# Altium project Common_Sensor_Box.PrjPCB (part 14 of 17)

## Sheet Sensor_Box_CAN_Shutter_CTRL_STM.SchDoc: Title
size 420 x 297 mm; Author: G.Kasprowicz; CompanyName: WUT ISE; DrawnBy: G.Kasprowicz; Organization: WUT ISE; Address1: PW ISE; Address2: Nowowiejska 15/19 00-665 Warsaw; Address3: gkasprow@gmail.com; Revision: 1.0; SheetNumber: -; SheetTotal: -; ModifiedBy: -; CheckedDate: -; Title2: Title2; DivGrp: WUT ISE; Designer: G.Kasprowicz; ModifiedDate: -; ProjectName: Sensor Box
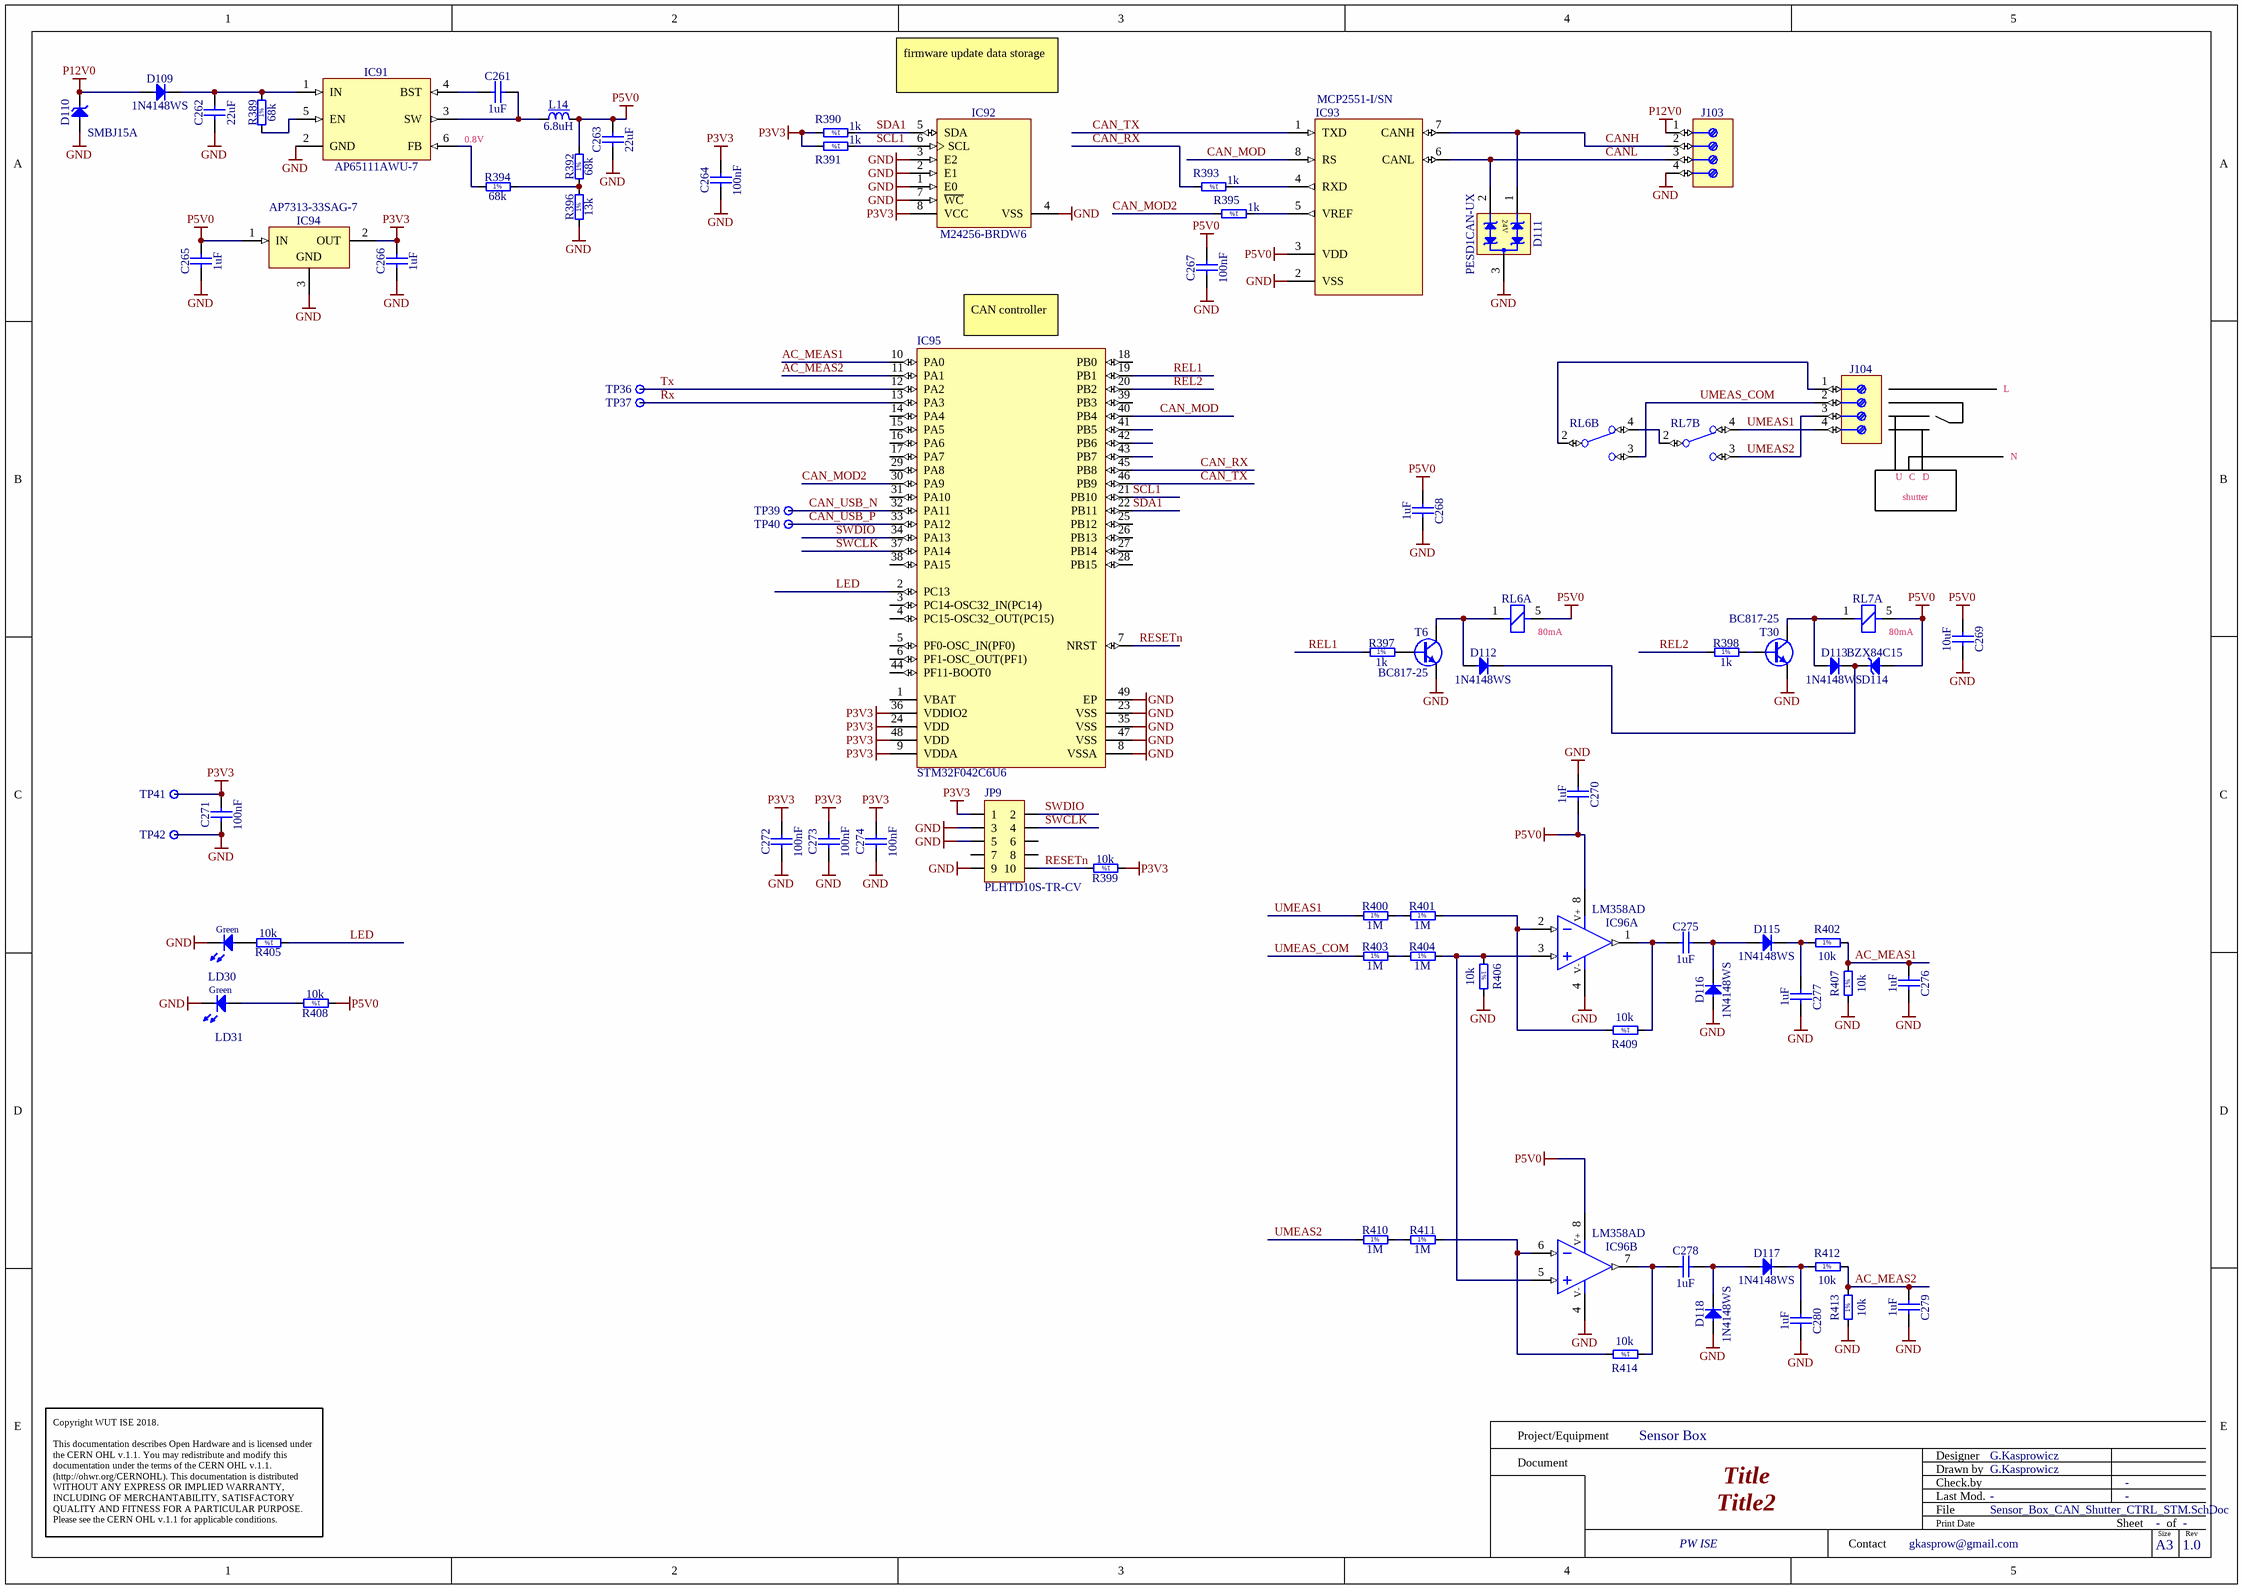
[diagram p19: Sensor_Box_CAN_Shutter_CTRL_STM.SchDoc]

### Parts
C261  1uF  [CAPC1005X55N]
C262  22uF  [CAPC1709X100N]
C263  22uF  [CAPC1709X100N]
C264  100nF  [CAPC1005X55N]
C265  1uF  [CAPC1005X55N]
C266  1uF  [CAPC1005X55N]
C267  100nF  [CAPC1005X55N]
C268  1uF  [CAPC1005X55N]
C269  10uF  [CAPC2012X135N]
C270  1uF  [CAPC1005X55N]
C271  100nF  [CAPC1005X55N]
C272  100nF  [CAPC1005X55N]
C273  100nF  [CAPC1005X55N]
C274  100nF  [CAPC1005X55N]
C275  1uF  [CAPC1005X55N]
C276  1uF  [CAPC1005X55N]
C277  1uF  [CAPC1005X55N]
C278  1uF  [CAPC1005X55N]
C279  1uF  [CAPC1005X55N]
C280  1uF  [CAPC1005X55N]
D109  1N4148WS  [SODFL2512X100N]
D110  SMBJ15A  [DIOM5336X265N]
D111  PESD1CAN-UX  [SOT95P237X112-3N]
D112  1N4148WS  [SODFL2512X100N]
D113  1N4148WS  [SODFL2512X100N]
D114  BZX84C15  [SOT95P240X130-3N]
D115  1N4148WS  [SODFL2512X100N]
D116  1N4148WS  [SODFL2512X100N]
D117  1N4148WS  [SODFL2512X100N]
D118  1N4148WS  [SODFL2512X100N]
IC91  AP65111AWU-7  [SOT95P280X100-6N]
IC92  M24256-BRDW6  [SOP65P640X120-8N]
IC93  MCP2551-I/SN  [SOIC127P600X175-8N]
IC94  AP7313-33SAG-7  [SOT95P240X130-3N]
IC95  STM32F042C6U6  [STM-UFQFPN48_L]
IC96  LM358AD  [SOIC127P600X175-8N]  (parts A,B of 2)
J103  (no value)  [PHOENIX_1725672]
J104  (no value)  [TYCO_282836-4]
JP9  PLHTD10S-TR-CV  [PLHTD10S-TR-CV]
L14  6.8uH  [IND_WALSIN_WLPN3030]
LD30  Green  [LED_KINGBRIGHT_KPH-1608CGCK]
LD31  Green  [LED_KINGBRIGHT_KPH-1608CGCK]
R389  68k  [RESC1005X40N]
R390  1k  [RESC1005X40N]
R391  1k  [RESC1005X40N]
R392  68k  [RESC1005X40N]
R393  1k  [RESC1005X40N]
R394  68k  [RESC1005X40N]
R395  1k  [RESC1005X40N]
R396  13k  [RESC1005X40N]
R397  1k  [RESC1005X40N]
R398  1k  [RESC1005X40N]
R399  10k  [RESC1005X40N]
R400  1M  [RESC3216X65N]
R401  1M  [RESC3216X65N]
R402  10k  [RESC1005X40N]
R403  1M  [RESC3216X65N]
R404  1M  [RESC3216X65N]
R405  10k  [RESC1005X40N]
R406  10k  [RESC1005X40N]
R407  10k  [RESC1005X40N]
R408  10k  [RESC1005X40N]
R409  10k  [RESC1005X40N]
R410  1M  [RESC3216X65N]
R411  1M  [RESC3216X65N]
R412  10k  [RESC1005X40N]
R413  10k  [RESC1005X40N]
R414  10k  [RESC1005X40N]
RL6  REL_OMRON_G5Q-1  [REL_OMRON_G5Q-1]  (value not drawn)  (parts A,B of 2)
RL7  REL_OMRON_G5Q-1  [REL_OMRON_G5Q-1]  (value not drawn)  (parts A,B of 2)
T6  BC817-25  [SOT95P230X110-3N]
T30  BC817-25  [SOT95P230X110-3N]
TP36  Test Point  [TPS127]  (value not drawn)
TP37  Test Point  [TPS127]  (value not drawn)
TP39  Test Point  [TPS127]  (value not drawn)
TP40  Test Point  [TPS127]  (value not drawn)
TP41  Test Point  [TPS127]  (value not drawn)
TP42  Test Point  [TPS127]  (value not drawn)

### Nets
GND: C262.1 C263.1 C264.1 C265.1 C266.1 C267.1 C268.2 C269.2 C270.1 C271.1 C272.1 C273.1 C274.1 C276.2 C277.2 C279.2 C280.2 D110.2(A) D111.3(GND) D116.2(A) D118.2(A) IC91.2(GND) IC92.1(E0) IC92.2(E1) IC92.3(E2) IC92.4(VSS) IC92.7(~{WC}) IC93.2(VSS) IC94.3(GND) IC95.8(VSSA) IC95.23(VSS) IC95.35(VSS) IC95.47(VSS) IC95.49(EP) IC96.4(V-) J103.4 JP9.3 JP9.5 JP9.9 LD30.1(C) LD31.1(C) R396.1 R406.2 R407.1 R413.1 T6.2(E) T30.2(E) TP42.1
P3V3: C264.2 C266.2 C271.2 C272.2 C273.2 C274.2 IC92.8(VCC) IC94.2(OUT) IC95.9(VDDA) IC95.24(VDD) IC95.36(VDDIO2) IC95.48(VDD) JP9.1 R390.2 R391.2 R399.1 TP41.1
P5V0: C263.2 C265.2 C267.2 C268.1 C269.1 C270.2 D114.1(A) IC93.3(VDD) IC94.1(IN) IC96.8(V+) L14.2 R392.2 R408.1 RL6.5 RL7.5
P12V0: D109.2(A) D110.1(C) J103.1
AC_MEAS1: C276.1 IC95.10(PA0) R402.2 R407.2
AC_MEAS2: C279.1 IC95.11(PA1) R412.2 R413.2
CAN_MOD: IC93.8(RS) IC95.40(PB4)
CAN_MOD2: IC95.30(PA9) R395.2
CAN_RX: IC95.45(PB8) R393.2
CAN_TX: IC93.1(TXD) IC95.46(PB9)
CAN_USB_N: IC95.32(PA11) TP39.1
CAN_USB_P: IC95.33(PA12) TP40.1
CANH: D111.1(I/O1) IC93.7(CANH) J103.2
CANL: D111.2(I/O2) IC93.6(CANL) J103.3
LED: IC95.2(PC13) R405.1
REL1: IC95.19(PB1) R397.1
REL2: IC95.20(PB2) R398.1
RESETn: IC95.7(NRST) JP9.10 R399.2
Rx: IC95.13(PA3) TP37.1
SCL1: IC92.6(SCL) IC95.21(PB10) R391.1
SDA1: IC92.5(SDA) IC95.22(PB11) R390.1
SWCLK: IC95.37(PA14) JP9.4
SWDIO: IC95.34(PA13) JP9.2
Tx: IC95.12(PA2) TP36.1
UMEAS1: J104.4 R400.1 RL7.4(NC)
UMEAS2: J104.3 R410.1 RL7.3(NO)
UMEAS_COM: J104.2 R403.1 RL6.3(NO)
NetC261_1: C261.1 IC91.4(BST)
NetC261_2: C261.2 IC91.3(SW) L14.1
NetC262_2: C262.2 D109.1(C) IC91.1(IN) R389.2
NetC275_1: C275.1 IC96.1(OUT) R409.1
NetC275_2: C275.2 D115.2(A) D116.1(C)
NetC277_1: C277.1 D115.1(C) R402.1
NetC278_1: C278.1 IC96.7(OUT) R414.1
NetC278_2: C278.2 D117.2(A) D118.1(C)
NetC280_1: C280.1 D117.1(C) R412.1
NetD112_1: D112.1(C) D113.1(C) D114.3(C)
NetD112_2: D112.2(A) RL6.1 T6.3(C)
NetD113_2: D113.2(A) RL7.1 T30.3(C)
NetIC91_5: IC91.5(EN) R389.1
NetIC91_6: IC91.6(FB) R394.1
NetIC93_4: IC93.4(RXD) R393.1
NetIC93_5: IC93.5(VREF) R395.1
NetIC96_2: IC96.2(IN-) R401.2 R409.2
NetIC96_3: IC96.3(IN+) IC96.5(IN+) R404.2 R406.1
NetIC96_6: IC96.6(IN-) R411.2 R414.2
NetJ104_1: J104.1 RL6.2(C)
NetLD30_2: LD30.2(A) R405.2
NetLD31_2: LD31.2(A) R408.2
NetR392_1: R392.1 R394.2 R396.2
NetR397_2: R397.2 T6.1(B)
NetR398_2: R398.2 T30.1(B)
NetR400_2: R400.2 R401.1
NetR403_2: R403.2 R404.1
NetR410_2: R410.2 R411.1
NetRL6_4: RL6.4(NC) RL7.2(C)

Not connected (* = marked no-connect by the designer): IC95 1(VBAT) 3(PC14-OSC32_IN(PC14)) 4(PC15-OSC32_OUT(PC15)) 5(PF0-OSC_IN(PF0)) 6(PF1-OSC_OUT(PF1)) 14(PA4) 15(PA5) 16(PA6) 17(PA7) 18(PB0) 25(PB12) 26(PB13) 27(PB14) 28(PB15) 29(PA8) 31(PA10) 38(PA15) 39(PB3) 41(PB5) 42(PB6) 43(PB7) 44(PF11-BOOT0); JP9 6 7 8

### Notes on the sheet
- firmware update data storage
- 0.8V
- (near IC95) CAN controller
- L
- N
- U
- shutter
- C
- D
- (near RL6) 80mA
- (near RL7) 80mA
- Project/Equipment
- Document
- Designer
- Drawn by
- Check.by
- Copyright WUT ISE 2018.
  This documentation describes Open Hardware and is licensed under the CERN OHL v.1.1. You may redistribute and modify this documentation under the terms of the CERN OHL v.1.1. (http://ohwr.org/CERNOHL). This documentation is distributed WITHOUT ANY EXPRESS OR IMPLIED WARRANTY, INCLUDING OF MERCHANTABILITY, SATISFACTORY QUALITY AND FITNESS FOR A PARTICULAR PURPOSE. Please see the CERN OHL v.1.1 for applicable conditions.
- Contact
- File
- Last Mod.
- Print Date
- Sheet
- Size
- A3
- of
- Rev
- (in symbol R0402_1K_1%_0.0625W_100PPM) 1%
- (in symbol R0402_10K_1%_0.0625W_100PPM) 1%
- (in symbol R0402_13K_1%_0.0625W_100PPM) 1%
- (in symbol R0402_68K_1%_0.0625W_100PPM) 1%
- (in symbol R1206_1M_1%_0.25W_100PPM) 1%

### Library data of the parts
C261 C265 C266 C268 C270 C275-C280 = CC0402_1UF_16V_10%_X5R: as C122 on sheet Sensor_Box_CAN_SENS; Part Number: CC0402_1UF_16V_10%_X5R; Component Kind: Standard; Component Type: Standard; Pin Count: 2; Value: 1uF; Status: Preferred; Manufacturer Part Number: CC0402_1UF_16V_10%_X5R; Case: 0402; Mounted: Yes; Socket: No; SMD: Yes; Sense: No; Manufacturer1 Example: TDK; Manufacturer1 ComponentHeight: 0.55mm; HelpURL: \\cern.ch\dfs\Applications\Altium\Datasheets\CC0402_X5R_TDK_C.pdf; Author: CERN DEM JLC; CreateDate: 25.10.2012; LatestRevisionDate: 25.10.2012
C262 C263 = CC0603_22UF_6.3V_20%_X5R: as C123 on sheet Sensor_Box_CAN_SENS; Part Number: CC0603_22UF_6.3V_20%_X5R; Component Kind: Standard; Component Type: Standard; Pin Count: 2; Value: 22uF; Status: None; Manufacturer Part Number: CC0603_22UF_6.3V_20%_X5R; Case: 0603; Mounted: Yes; Socket: No; SMD: Yes; Sense: No; Manufacturer1 Example: TDK; Manufacturer1 ComponentHeight: 1mm; HelpURL: \\cern.ch\dfs\Applications\Altium\Datasheets\CC0603_X5R_TDK_C.pdf; Author: CERN DEM JLC; CreateDate: 16.12.2013; LatestRevisionDate: 13.09.2016
C264 C267 C271-C274 = CC0402_100NF_16V_10%_X5R: as C120 on sheet Sensor_Box_CAN_SENS; Part Number: CC0402_100NF_16V_10%_X5R; Component Kind: Standard; Component Type: Standard; Pin Count: 2; Value: 100nF; Status: None; Manufacturer Part Number: CC0402_100NF_16V_10%_X5R; Case: 0402; Mounted: Yes; Socket: No; SMD: Yes; Sense: No; Manufacturer1 Example: MURATA; Manufacturer1 ComponentHeight: 0.55mm; HelpURL: \\cern.ch\dfs\Applications\Altium\Datasheets\CC0402_X5R_MURATA_GRM.pdf; Author: CERN DEM JLC; CreateDate: 10.12.2013; LatestRevisionDate: 10.12.2013
C269 = CC0805_10UF_16V_10%_X5R: as C194 on sheet Sensor_Box_CAN_Shutter_CTRL; Part Number: CC0805_10UF_16V_10%_X5R; Component Kind: Standard; Component Type: Standard; Pin Count: 2; Value: 10uF; Status: Preferred; Manufacturer Part Number: CC0805_10UF_16V_10%_X5R; Case: 0805; Mounted: Yes; Socket: No; SMD: Yes; Manufacturer1 Example: KEMET; Manufacturer1 ComponentHeight: 1.4mm; HelpURL: \\cern.ch\dfs\Applications\Altium\Datasheets\CC1206_X5R_KEMET.pdf; Author: CERN DEM JLC; CreateDate: 03.12.2007; LatestRevisionDate: 03.12.2007; Sense: No
D109 D112 D113 D115-D118 = 1N4148WS: as D29 on sheet Sensor_Box_CAN_SENS; Part Number: 1N4148WS; Component Kind: Standard; Component Type: Standard; Device: 1N4148WS; PackageDescription: SODFL Diode; 1.70mm W X 1.25mm L X 1.00mm H body, IPC Medium Density; Manufacturer Part Number: 1N4148WS; Pin Count: 2; Case: SOD-323F; Mounted: Yes; Socket: No; SMD: Yes; Sense: No; ComponentHeight: 1mm; HelpURL: \\cern.ch\dfs\Applications\Altium\Datasheets\1N4148WS.pdf; Author: CERN DEM JLC; CreateDate: 12.05.2011; LatestRevisionDate: 12.05.2011
D110 = SMBJ15A: as D62 on sheet Sensor_Box_CAN_SENS; Part Number: SMBJ15A; Component Kind: Standard; Component Type: Standard; Device: SMBJ15A; PackageDescription: DO-214-AA/SMB Diode, Molded Body; 5.34mm L X 3.625mm W X 2.65mm H, IPC Medium Density; Manufacturer Part Number: SMBJ15A; Pin Count: 2; Case: DO-214AA; Mounted: Yes; Socket: No; SMD: Yes; Sense: No; ComponentHeight: 2.65mm; HelpURL: \\cern.ch\dfs\Applications\Altium\Datasheets\SMBJ.pdf; Author: CERN DEM JLC; CreateDate: 08.12.2008; LatestRevisionDate: 19.12.2011
D111 = D_TVS_PESD1CAN: as D28 on sheet Sensor_Box_CAN_SENS; Part Number: PESD1CAN-UX; Component Kind: Standard; Component Type: Standard; Device: PESD1CAN-UX; PackageDescription: SOT, 0.95mm, pitch; 3 pin,1.30mm W X 2.92mm L X 1.12mm H body, IPC Medium Density; Part Description: TVS Diode for CAN; Manufacturer Part Number: PESD1CAN-UX; Pin Count: 3; Case: SOT-23; Mounted: Yes; Socket: No; SMD: Yes; Sense: No; ComponentHeight: 1.12mm; HelpURL: \\cern.ch\dfs\Applications\Altium\Datasheets\SM712.TCT.pdf; Author: CERN DEM JLC; CreateDate: 03.09.2014; LatestRevisionDate: 13.01.2015
D114 = BZX84C15: as D68 on sheet Sensor_Box_CAN_Shutter_CTRL; Part Number: BZX84C15; Component Kind: Standard; Component Type: Standard; Device: BZX84C15; PackageDescription: SOT23 3-Leads, Pitch 0.95mm - Body 1.3x2.9mm, IPC Medium Density; Manufacturer Part Number: BZX84C15; Pin Count: 3; Case: SOT23-3; Mounted: Yes; Socket: No; SMD: Yes; Sense: No; ComponentHeight: 1.3mm; HelpURL: \\cern.ch\dfs\Applications\Altium\Datasheets\BZX84C15.pdf; Author: CERN DEM JLC; CreateDate: 30.11.2011; LatestRevisionDate: 30.11.2011
IC91 = AP65111AWU-7: as IC36 on sheet Sensor_Box_CAN_SENS; Part Number: AP65111AWU-7; Component Kind: Standard; Component Type: Standard; Device: AP65111AWU-7; PackageDescription: SOT23, 0.95mm pitch; 6 pin, 1.625mm W X 2.90mm L X 1.00mm H body, IPC Medium Density; Part Description: Light Load Improved 1.5A Synch DC/DC Buck Converter; Manufacturer Part Number: AP65111AWU-7; Pin Count: 6; Case: SOT23-6; Mounted: Yes; Socket: No; SMD: Yes; Sense: No; ComponentHeight: 1.1mm; HelpURL: \\cern.ch\dfs\Applications\Altium\Datasheets\AP65111AWU-7.pdf; Author: CERN DEM JLC; CreateDate: 20.03.2018; LatestRevisionDate: 20.03.2018
IC92 = MEM_M24256-BRDW6P: as IC29 on sheet Sensor_Box_CAN_SENS; Part Number: M24256-BRDW6P; Component Kind: Standard; Component Type: Standard; Device: M24256-BRDW6; PackageDescription: SOP, 0.65mm pitch; 8 pin, 4.40mm W X 3.00mm L X 1.20mm H body, IPC Medium Density; Part Description: 256-Kbit Serial I²C Bus EEPROM; Manufacturer Part Number: M24256-BRDW6; Pin Count: 8; Case: TSSOP8; Mounted: Yes; Socket: No; SMD: Yes; Sense: No; ComponentHeight: 1.2mm; HelpURL: \\cern.ch\dfs\Applications\Altium\Datasheets\M24256-BRDW6P.pdf; Author: CERN DEM MR; CreateDate: 17.03.2016; LatestRevisionDate: 17.03.2016
IC93 = IFC_MCP2551: as IC34 on sheet Sensor_Box_CAN_SENS; Part Number: MCP2551-I/SN; Component Kind: Standard; Component Type: Standard; Device: MCP2551-I/SN; PackageDescription: SOIC 8, Pitch 1.27mm - Body 4x5mm, IPC Medium Density; Part Description: High-Speed CAN Transceiver; Manufacturer Part Number: MCP2551-I/SN; Pin Count: 8; Case: SOIC8; Mounted: Yes; Socket: No; SMD: Yes; Sense: No; ComponentHeight: 1.75mm; Author: GK; CreateDate: 07.09.2016; LatestRevisionDate: 07.09.2016
IC94 = AP7313-33SAG-7: as IC105 on sheet Sensor_Box_CAN_SENS; Part Number: AP7313-33SAG-7; Component Kind: Standard; Component Type: Standard; Device: AP7313-33SAG-7; PackageDescription: SOT23 3-Leads, Pitch 0.95mm - Body 1.3x2.9mm, IPC Medium Density; Manufacturer Part Number: AP7313-33SAG-7; Pin Count: 3; Case: SOT23; Mounted: Yes; Socket: No; SMD: Yes; Sense: No; ComponentHeight: 1.35mm; HelpURL: \\cern.ch\dfs\Applications\Altium\Datasheets\AP7313-33SAG-7.pdf; Author: CERN DEM JLC; CreateDate: 20.03.2018; LatestRevisionDate: 20.03.2018
IC95 = CMP-0304-00104-1: as IC104 on sheet Sensor_Box_CAN_SENS; ComponentLink2Description: Datasheet; Mounting Technology: Surface Mount; ComponentLink1Description: Manufacturer URL; ComponentLink1URL: http://www.st.com/; Core: ARM Cortex-M0; Package Reference: UFQFPN48; Packing: Tray; ComponentLink2URL: http://www.st.com/st-web-ui/static/active/en/resource/technical/document/datasheet/DM00105814.pdf; DatasheetVersion: Rev. 5; Package Description: 48-Pin Ultra Thin Fine Pitch Quad Flat No-Lead, 7 x 7 x 0.6 mm Body, 0.5 mm Pitch, Exposed Pad
IC96 = LM358AD: as IC67 on sheet Sensor_Box_CAN_Shutter_CTRL; Part Number: LM358AD; Component Kind: Standard; Component Type: Standard; Device: LM358AD; PackageDescription: SOIC 8, Pitch 1.27mm - Body 4x5mm, IPC Medium Density; Part Description: Dual Operational Amplifier; Manufacturer Part Number: LM358AD; Pin Count: 8; Case: SOIC8; Mounted: Yes; Socket: No; SMD: Yes; Sense: No; ComponentHeight: 1.75mm; Author: CERN DEM JLC; HelpURL: \\cern.ch\dfs\Applications\Altium\Datasheets\LM358AD.pdf; CreateDate: 02.12.2008; LatestRevisionDate: 13.04.2010
J103 = PHOENIX_1725672: as J48 on sheet Sensor_Box_CAN_SENS; Part Number: PHOENIX_1725672; Component Kind: Standard; Component Type: Standard; Pin Count: 4; Mounted: Yes; Socket: No; SMD: No; Sense: No; Status: None; ComponentHeight: 8.5mm; HelpURL: \\cern.ch\dfs\Applications\Altium\Datasheets\PHOENIX_1725672.pdf; Author: CERN DEM JMW; CreateDate: 07.11.2008; LatestRevisionDate: 26.04.2010
J104 = TYCO_282836-4: as J83 on sheet Sensor_Box_CAN_Shutter_CTRL; Part Number: TYCO_282836-4; Component Kind: Standard; Component Type: Standard; Pin Count: 4; Mounted: Yes; Socket: No; SMD: No; Sense: No; Status: None; Manufacturer Part Number: 282836-4; ComponentHeight: 10mm; HelpURL: \\cern.ch\dfs\Applications\Altium\Datasheets\TYCO_282836-4.pdf; Author: CERN DEM JLC; CreateDate: 10.11.2014; LatestRevisionDate: 10.11.2014
JP9 = CON_2x5 1.27 SMT Male: 1.27 mm dual row goldpin (Maritex)
L14 = IND_WLPN3030: as L9 on sheet Sensor_Box_CAN_SENS; Component Kind: Standard; Component Type: Standard; Pin Count: 2; Value: 6.8uH; Status: None; Power: 900mA; Mounted: Yes; Socket: No; SMD: Yes; Sense: No; ComponentHeight: 1.5; HelpURL: \\cern.ch\dfs\Applications\Altium\Datasheets\IND_MURATA-PS_8200.pdf; Author: GK; CreateDate: 11.07.2016; LatestRevisionDate: 11.07.2016
LD30 LD31 = LED_KINGBRIGHT_KPH-1608CGCK: as LD6#2 on sheet Sensor_Box_CAN_Shutter_CTRL; Part Number: LED_KINGBRIGHT_KPH-1608CGCK; Component Kind: Standard; Component Type: Standard; Color: Green; PackageDescription: SMT Green LED, Case 0603, Body L 1.6 x W 0.8mm H 0.65mm; Manufacturer: KINGBRIGHT; Manufacturer Part Number: KPH-1608CGCK; Pin Count: 2; Mounted: Yes; Socket: No; SMD: Yes; Sense: No; ComponentHeight: 0.65mm; HelpURL: \\cern.ch\dfs\Applications\Altium\Datasheets\LED_KINGBRIGHT_KPH-1608CGCK.pdf; Author: CERN DEM JLC; CreateDate: 03.07.2017; LatestRevisionDate: 03.07.2017
R389 R392 R394 = R0402_68K_1%_0.0625W_100PPM: as R135 on sheet Sensor_Box_CAN_SENS; Part Number: R0402_68K_1%_0.0625W_100PPM; Component Kind: Standard; Component Type: Standard; Pin Count: 2; Value: 68k; Status: Not Recommended; Power: 0.0625W; Tolerance: ±1%; Manufacturer Part Number: R0402_68K_1%_0.0625W_100PPM; Case: 0402; Mounted: Yes; Sense: No; Socket: No; SMD: Yes; Manufacturer1 Example: YAGEO PHYCOMP; Manufacturer1 ComponentHeight: 0.4mm; HelpURL: \\cern.ch\dfs\Applications\Altium\Datasheets\R0402_Phycomp_RC0402.pdf; Author: CERN DEM JLC; CreateDate: 03.12.2007; LatestRevisionDate: 17.10.2012
R390 R391 R393 R395 R397 R398 = R0402_1K_1%_0.0625W_100PPM: as R215#3 on sheet Sensor_Box_CAN_SENS; Part Number: R0402_1K_1%_0.0625W_100PPM; Component Kind: Standard; Component Type: Standard; Pin Count: 2; Value: 1k; Status: Not Recommended; Power: 0.0625W; Tolerance: ±1%; Manufacturer Part Number: R0402_1K_1%_0.0625W_100PPM; Case: 0402; Mounted: Yes; Sense: No; Socket: No; SMD: Yes; Manufacturer1 Example: YAGEO PHYCOMP; Manufacturer1 ComponentHeight: 0.4mm; HelpURL: \\cern.ch\dfs\Applications\Altium\Datasheets\R0402_Phycomp_RC0402.pdf; Author: CERN DEM JLC; CreateDate: 03.12.2007; LatestRevisionDate: 17.10.2012
R396 = R0402_13K_1%_0.0625W_100PPM: as R137 on sheet Sensor_Box_CAN_SENS; Part Number: R0402_13K_1%_0.0625W_100PPM; Component Kind: Standard; Component Type: Standard; Pin Count: 2; Value: 13k; Status: Not Recommended; Power: 0.0625W; Tolerance: ±1%; Manufacturer Part Number: R0402_13K_1%_0.0625W_100PPM; Case: 0402; Mounted: Yes; Sense: No; Socket: No; SMD: Yes; Manufacturer1 Example: YAGEO PHYCOMP; Manufacturer1 ComponentHeight: 0.4mm; HelpURL: \\cern.ch\dfs\Applications\Altium\Datasheets\R0402_Phycomp_RC0402.pdf; Author: CERN DEM JLC; CreateDate: 03.12.2007; LatestRevisionDate: 17.10.2012
R399 R405 R408 = R0402_10K_1%_0.0625W_100PPM: as R133 on sheet Sensor_Box_CAN_SENS; Part Number: R0402_10K_1%_0.0625W_100PPM; Component Kind: Standard; Component Type: Standard; Pin Count: 2; Value: 10k; Status: Not Recommended; Power: 0.0625W; Tolerance: ±1%; Manufacturer Part Number: R0402_10K_1%_0.0625W_100PPM; Case: 0402; Mounted: Yes; Sense: No; Socket: No; SMD: Yes; Manufacturer1 Example: YAGEO PHYCOMP; Manufacturer1 ComponentHeight: 0.4mm; HelpURL: \\cern.ch\dfs\Applications\Altium\Datasheets\R0402_Phycomp_RC0402.pdf; Author: CERN DEM JLC; CreateDate: 03.12.2007; LatestRevisionDate: 17.10.2012
R400 R401 R403 R404 R410 R411 = R1206_1M_1%_0.25W_100PPM: as R158 on sheet Sensor_Box_CAN_Shutter_CTRL; Part Number: R1206_1M_1%_0.25W_100PPM; Component Kind: Standard; Component Type: Standard; Pin Count: 2; Value: 1M; Status: Preferred; Tolerance: ±1%; Manufacturer Part Number: R1206_1M_1%_0.25W_100PPM; Case: 1206; Mounted: Yes; Sense: No; Socket: No; SMD: Yes; Manufacturer1 Example: NIC COMPONENT; Manufacturer1 ComponentHeight: 0.65mm; HelpURL: \\cern.ch\dfs\Applications\Altium\Datasheets\R1206_NIC_NRC.pdf; Author: CERN DEM JLC; CreateDate: 03.12.2007; LatestRevisionDate: 13.03.2008
R402 R406 R407 R409 R412-R414 = R0402_10K_1%_0.0625W_100PPM: as R139-R141 on sheet Sensor_Box_CAN_SENS; Part Number: R0402_10K_1%_0.0625W_100PPM; Component Kind: Standard; Component Type: Standard; Pin Count: 2; Value: 10k; Status: Not recommended; Power: 0.0625W; Tolerance: ±1%; Manufacturer Part Number: R0402_10K_1%_0.0625W_100PPM; Case: 0402; Mounted: Yes; Socket: No; SMD: Yes; Manufacturer1 Example: YAGEO PHYCOMP; Manufacturer1 ComponentHeight: 0.4mm; HelpURL: \\cern.ch\dfs\Applications\Altium\Datasheets\R0402_Phycomp_RC0402.pdf; Author: CERN DEM JLC; CreateDate: 2007-12-03; LatestRevisionDate: 2012-10-17
RL6 RL7 = REL_OMRON_G5Q-1-5VDC: as RL1 on sheet Sensor_Box_CAN_Shutter_CTRL; Part Number: REL_OMRON_G5Q-1-5VDC; Component Kind: Standard; Component Type: Standard; Pin Count: 5; PackageDescription: 5 Leads, Row Spacing 7.62mm; Body 20.3mm x 10.3mm, OMRON_G5Q-1 Series; Mounted: Yes; Socket: No; SMD: No; Sense: No; Status: None; Part Description: SPDT, Power Relay, 10A Switching Capacity, G5Q-1 Series; ComponentHeight: 15.8mm; HelpURL: \\cern.ch\dfs\Applications\Altium\Datasheets\REL_OMRON_G5Q-1.pdf; Author: CERN DEM MR; CreateDate: 09.06.2016; LatestRevisionDate: 09.06.2016
T6 T30 = BC817-25: as T16 on sheet Sensor_Box_CAN_Shutter_CTRL; Part Number: BC817-25; Component Kind: Standard; Component Type: Standard; Device: BC817-25; PackageDescription: SOT23, 3 pin, Pitch 0.95mm - 1.3mm W X 2.9mm L X 1.1mm H, IPC Medium Density; Manufacturer Part Number: BC817-25; Pin Count: 3; Case: SOT23-3; Mounted: Yes; Socket: No; SMD: Yes; Sense: No; ComponentHeight: 1.1mm; HelpURL: \\cern.ch\dfs\Applications\Altium\Datasheets\BC817-25.pdf; Author: CERN DEM JLC; CreateDate: 28.10.2014; LatestRevisionDate: 28.10.2014
TP36 TP37 TP39-TP42 = SMD_PAD_1.27X1.27MM: as TP5 on sheet Sensor_Box_CAN_SENS; Part Number: SMD_PAD_1.27X1.27MM; Component Kind: Standard (No BOM); Component Type: Standard (No BOM); Pin Count: 1; Family: Test Point; Socket: No; SMD: Yes; Sense: No; Status: None; ComponentHeight: 0mm; HelpURL: Undefined; Author: CERN DEM JLC; CreateDate: 12.01.2008; LatestRevisionDate: 12.01.2008; PackageDescription: 1.27mm x 1.27mm PCB Copper Area (SMD Test Point)

## Sheet Sensor_Box_CAN_Switch_STM.SchDoc: Title
size 420 x 297 mm; Author: G.Kasprowicz; CompanyName: WUT ISE; DrawnBy: G.Kasprowicz; Organization: WUT ISE; Address1: PW ISE; Address2: Nowowiejska 15/19 00-665 Warsaw; Address3: gkasprow@gmail.com; Revision: 1.0; SheetNumber: -; SheetTotal: -; ModifiedBy: -; CheckedDate: -; Title2: Title2; DivGrp: WUT ISE; Designer: G.Kasprowicz; ModifiedDate: -; ProjectName: Sensor Box
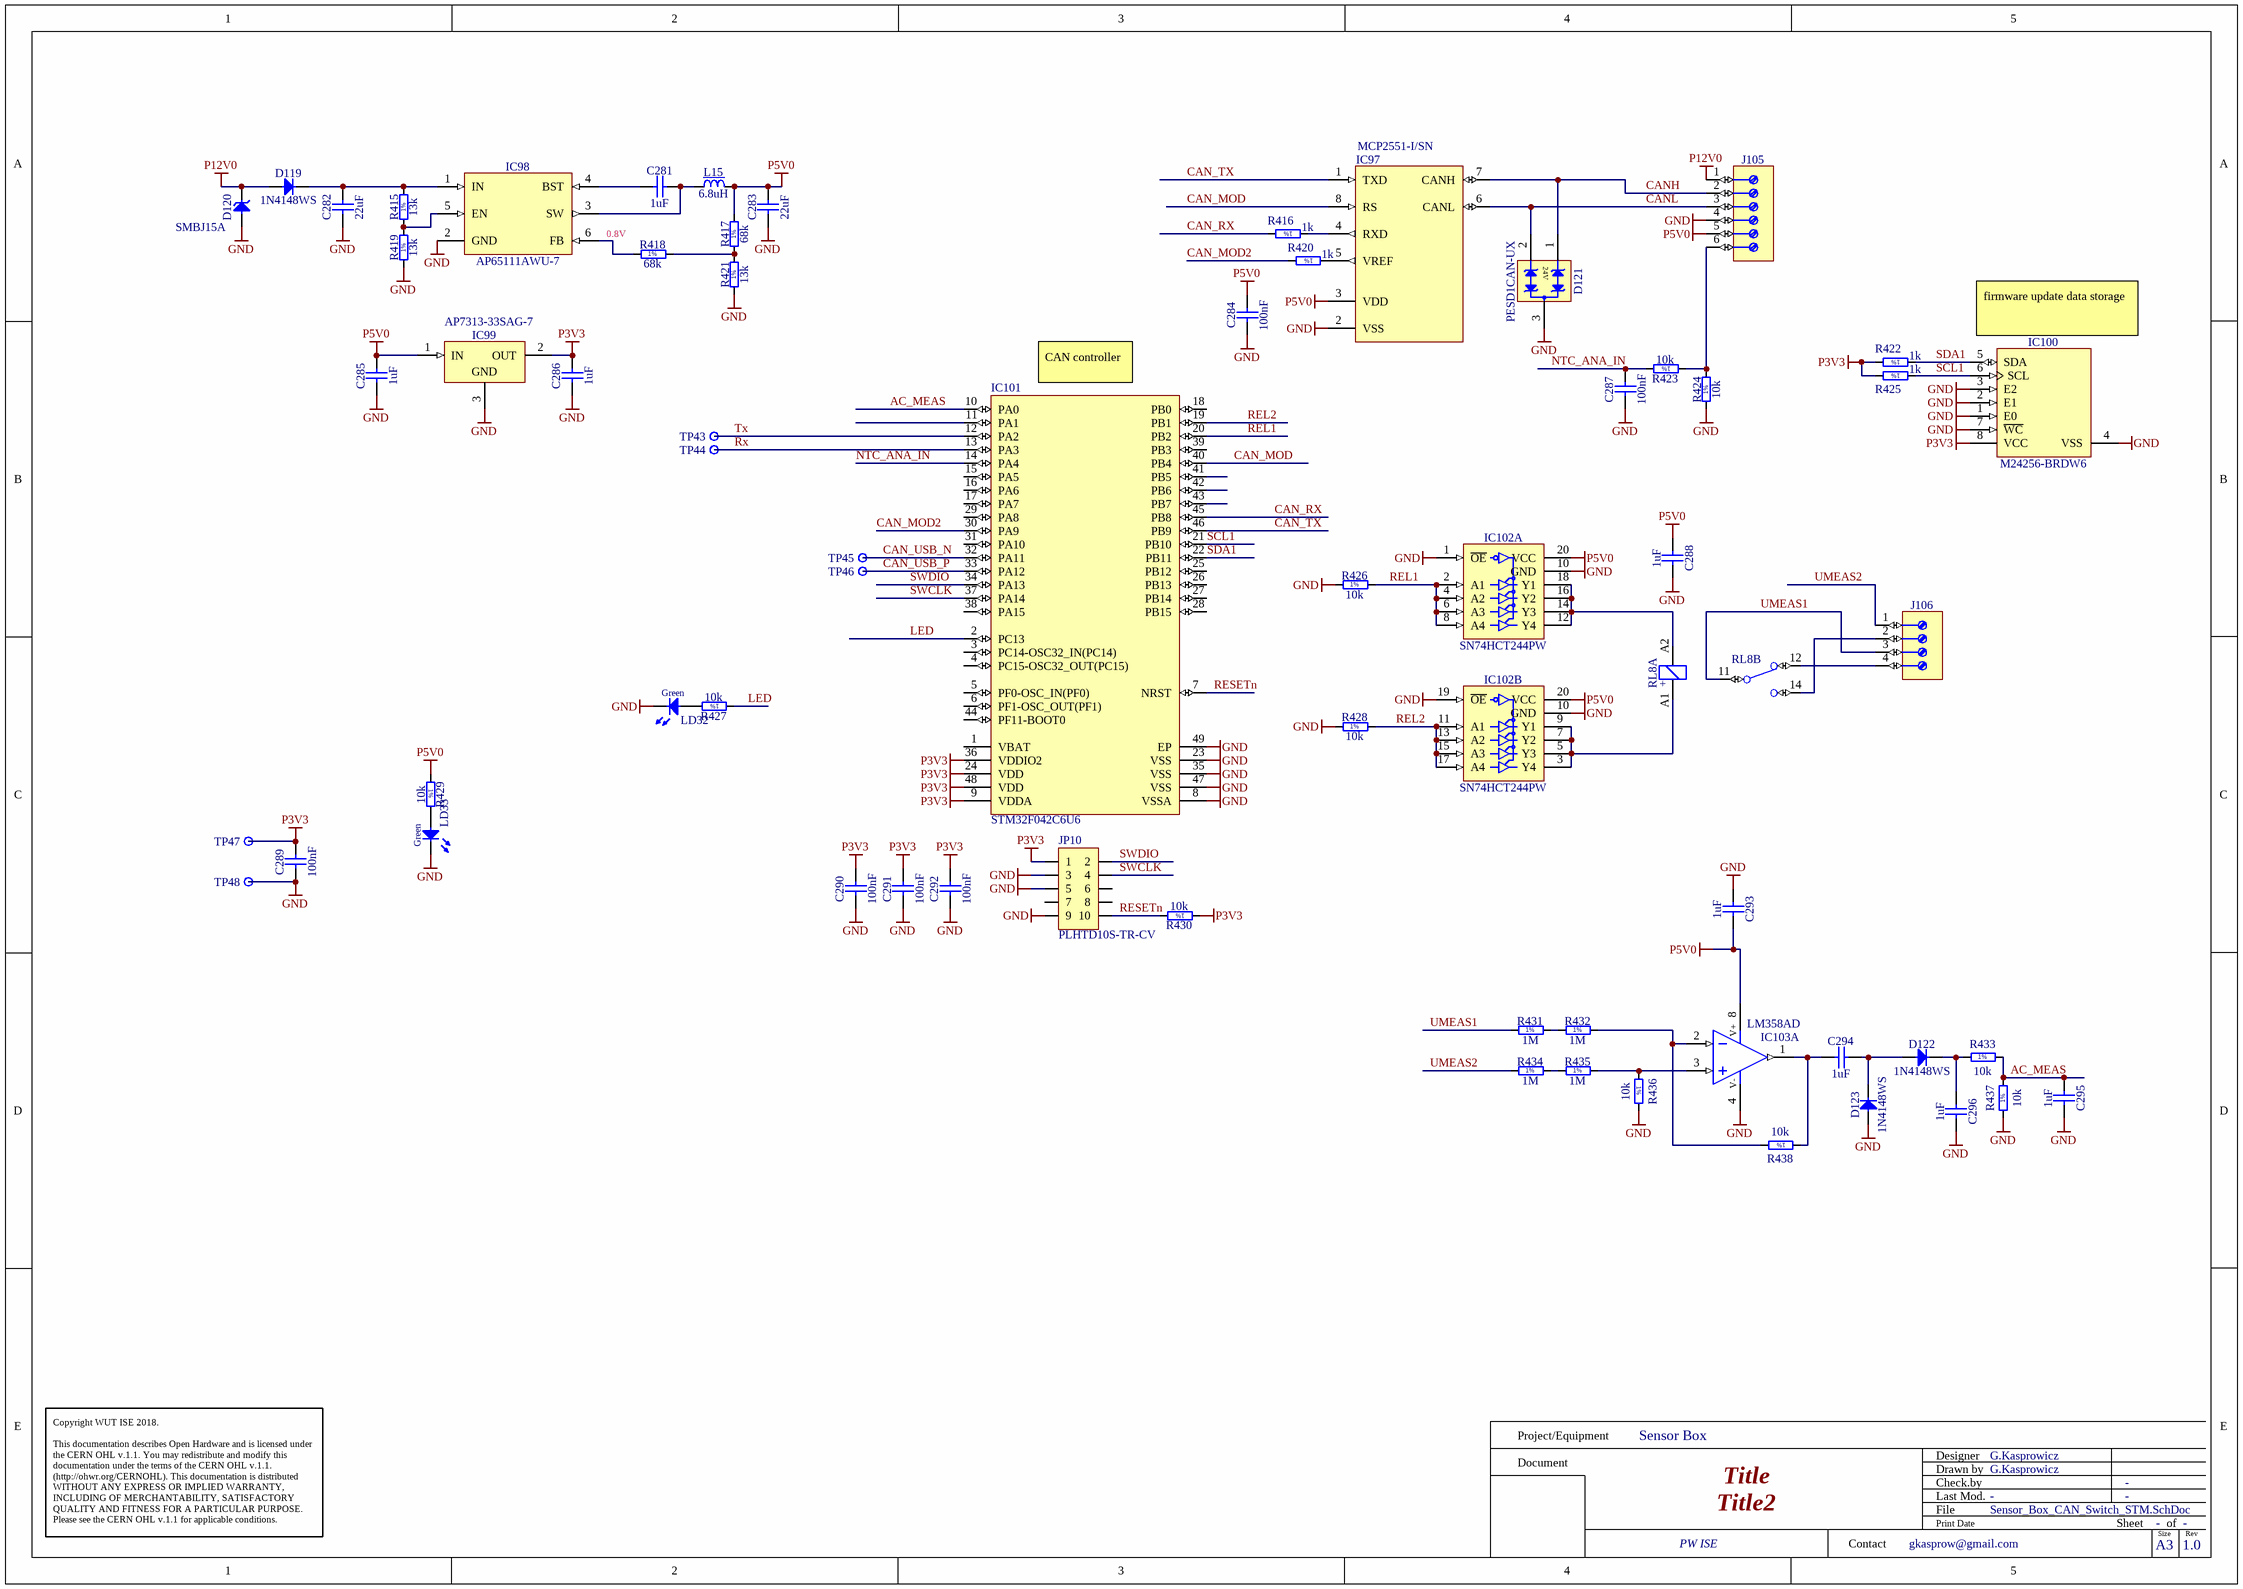
[diagram p20: Sensor_Box_CAN_Switch_STM.SchDoc]

### Parts
C281  1uF  [CAPC1005X55N]
C282  22uF  [CAPC1709X100N]
C283  22uF  [CAPC1709X100N]
C284  100nF  [CAPC1005X55N]
C285  1uF  [CAPC1005X55N]
C286  1uF  [CAPC1005X55N]
C287  100nF  [CAPC1005X55N]
C288  1uF  [CAPC1005X55N]
C289  100nF  [CAPC1005X55N]
C290  100nF  [CAPC1005X55N]
C291  100nF  [CAPC1005X55N]
C292  100nF  [CAPC1005X55N]
C293  1uF  [CAPC1005X55N]
C294  1uF  [CAPC1005X55N]
C295  1uF  [CAPC1005X55N]
C296  1uF  [CAPC1005X55N]
D119  1N4148WS  [SODFL2512X100N]
D120  SMBJ15A  [DIOM5336X265N]
D121  PESD1CAN-UX  [SOT95P237X112-3N]
D122  1N4148WS  [SODFL2512X100N]
D123  1N4148WS  [SODFL2512X100N]
IC97  MCP2551-I/SN  [SOIC127P600X175-8N]
IC98  AP65111AWU-7  [SOT95P280X100-6N]
IC99  AP7313-33SAG-7  [SOT95P240X130-3N]
IC100  M24256-BRDW6  [SOP65P640X120-8N]
IC101  STM32F042C6U6  [STM-UFQFPN48_L]
IC102  SN74HCT244PW  [SOP65P640X120-20N]  (parts A,B of 2)
IC103  LM358AD  [SOIC127P600X175-8N]  (part A of 2)
J105  (no value)  [PHOENIX_1725698]
J106  (no value)  [TYCO_282836-4]
JP10  PLHTD10S-TR-CV  [PLHTD10S-TR-CV]
L15  6.8uH  [IND_WALSIN_WLPN3030]
LD32  Green  [LED_KINGBRIGHT_KPH-1608CGCK]
LD33  Green  [LED_KINGBRIGHT_KPH-1608CGCK]
R415  13k  [RESC1005X40N]
R416  1k  [RESC1005X40N]
R417  68k  [RESC1005X40N]
R418  68k  [RESC1005X40N]
R419  13k  [RESC1005X40N]
R420  1k  [RESC1005X40N]
R421  13k  [RESC1005X40N]
R422  1k  [RESC1005X40N]
R423  10k  [RESC1005X40N]
R424  10k  [RESC1005X40N]
R425  1k  [RESC1005X40N]
R426  10k  [RESC1005X40N]
R427  10k  [RESC1005X40N]
R428  10k  [RESC1005X40N]
R429  10k  [RESC1005X40N]
R430  10k  [RESC1005X40N]
R431  1M  [RESC3216X65N]
R432  1M  [RESC3216X65N]
R433  10k  [RESC1005X40N]
R434  1M  [RESC3216X65N]
R435  1M  [RESC3216X65N]
R436  10k  [RESC1005X40N]
R437  10k  [RESC1005X40N]
R438  10k  [RESC1005X40N]
RL8  REL_TYCO_PE01  [REL_TYCO_PE01]  (value not drawn)  (parts A,B of 2)
TP43  Test Point  [TPS127]  (value not drawn)
TP44  Test Point  [TPS127]  (value not drawn)
TP45  Test Point  [TPS127]  (value not drawn)
TP46  Test Point  [TPS127]  (value not drawn)
TP47  Test Point  [TPS127]  (value not drawn)
TP48  Test Point  [TPS127]  (value not drawn)

### Nets
GND: C282.1 C283.1 C284.1 C285.1 C286.1 C287.1 C288.2 C289.1 C290.1 C291.1 C292.1 C293.1 C295.2 C296.2 D120.2(A) D121.3(GND) D123.2(A) IC97.2(VSS) IC98.2(GND) IC99.3(GND) IC100.1(E0) IC100.2(E1) IC100.3(E2) IC100.4(VSS) IC100.7(~{WC}) IC101.8(VSSA) IC101.23(VSS) IC101.35(VSS) IC101.47(VSS) IC101.49(EP) IC102.1(~{OE}) IC102.10(GND) IC102.19(~{OE}) IC103.4(V-) J105.4 JP10.3 JP10.5 JP10.9 LD32.1(C) LD33.1(C) R419.1 R421.1 R424.1 R426.1 R428.1 R436.2 R437.1 TP48.1
P3V3: C286.2 C289.2 C290.2 C291.2 C292.2 IC99.2(OUT) IC100.8(VCC) IC101.9(VDDA) IC101.24(VDD) IC101.36(VDDIO2) IC101.48(VDD) JP10.1 R422.2 R425.2 R430.1 TP47.1
P5V0: C283.2 C284.2 C285.2 C288.1 C293.2 IC97.3(VDD) IC99.1(IN) IC102.20(VCC) IC103.8(V+) J105.5 L15.2 R417.2 R429.1
P12V0: D119.2(A) D120.1(C) J105.1
AC_MEAS: C295.1 IC101.10(PA0) R433.2 R437.2
CAN_MOD: IC97.8(RS) IC101.40(PB4)
CAN_MOD2: IC101.30(PA9) R420.2
CAN_RX: IC101.45(PB8) R416.2
CAN_TX: IC97.1(TXD) IC101.46(PB9)
CAN_USB_N: IC101.32(PA11) TP45.1
CAN_USB_P: IC101.33(PA12) TP46.1
CANH: D121.1(I/O1) IC97.7(CANH) J105.2
CANL: D121.2(I/O2) IC97.6(CANL) J105.3
LED: IC101.2(PC13) R427.1
NTC_ANA_IN: C287.2 IC101.14(PA4) R423.2
REL1: IC101.20(PB2) IC102.2(A1) IC102.4(A2) IC102.6(A3) IC102.8(A4) R426.2
REL2: IC101.19(PB1) IC102.11(A1) IC102.13(A2) IC102.15(A3) IC102.17(A4) R428.2
RESETn: IC101.7(NRST) JP10.10 R430.2
Rx: IC101.13(PA3) TP44.1
SCL1: IC100.6(SCL) IC101.21(PB10) R425.1
SDA1: IC100.5(SDA) IC101.22(PB11) R422.1
SWCLK: IC101.37(PA14) JP10.4
SWDIO: IC101.34(PA13) JP10.2
Tx: IC101.12(PA2) TP43.1
UMEAS1: J106.3 R431.1 RL8.11(C)
UMEAS2: J106.1 R434.1
NetC281_1: C281.1 IC98.4(BST)
NetC281_2: C281.2 IC98.3(SW) L15.1
NetC282_2: C282.2 D119.1(C) IC98.1(IN) R415.2
NetC294_1: C294.1 IC103.1(OUT) R438.1
NetC294_2: C294.2 D122.2(A) D123.1(C)
NetC296_1: C296.1 D122.1(C) R433.1
NetIC97_4: IC97.4(RXD) R416.1
NetIC97_5: IC97.5(VREF) R420.1
NetIC98_5: IC98.5(EN) R415.1 R419.2
NetIC98_6: IC98.6(FB) R418.1
NetIC102_3: IC102.3(Y4) IC102.5(Y3) IC102.7(Y2) IC102.9(Y1) RL8.A1
NetIC102_12: IC102.12(Y4) IC102.14(Y3) IC102.16(Y2) IC102.18(Y1) RL8.A2
NetIC103_2: IC103.2(IN-) R432.2 R438.2
NetIC103_3: IC103.3(IN+) R435.2 R436.1
NetJ105_6: J105.6 R423.1 R424.2
NetJ106_2: J106.2 RL8.14(NO)
NetJ106_4: J106.4 RL8.12(NC)
NetLD32_2: LD32.2(A) R427.2
NetLD33_2: LD33.2(A) R429.2
NetR417_1: R417.1 R418.2 R421.2
NetR431_2: R431.2 R432.1
NetR434_2: R434.2 R435.1

Not connected (* = marked no-connect by the designer): IC101 1(VBAT) 3(PC14-OSC32_IN(PC14)) 4(PC15-OSC32_OUT(PC15)) 5(PF0-OSC_IN(PF0)) 6(PF1-OSC_OUT(PF1)) 11(PA1) 15(PA5) 16(PA6) 17(PA7) 18(PB0) 25(PB12) 26(PB13) 27(PB14) 28(PB15) 29(PA8) 31(PA10) 38(PA15) 39(PB3) 41(PB5) 42(PB6) 43(PB7) 44(PF11-BOOT0); JP10 6 7 8

### Notes on the sheet
- 0.8V
- (near IC101) CAN controller
- (near IC100) firmware update data storage
- Project/Equipment
- Document
- Designer
- Drawn by
- Check.by
- Copyright WUT ISE 2018.
  This documentation describes Open Hardware and is licensed under the CERN OHL v.1.1. You may redistribute and modify this documentation under the terms of the CERN OHL v.1.1. (http://ohwr.org/CERNOHL). This documentation is distributed WITHOUT ANY EXPRESS OR IMPLIED WARRANTY, INCLUDING OF MERCHANTABILITY, SATISFACTORY QUALITY AND FITNESS FOR A PARTICULAR PURPOSE. Please see the CERN OHL v.1.1 for applicable conditions.
- Contact
- File
- Last Mod.
- Print Date
- Sheet
- Size
- A3
- of
- Rev
- (in symbol R0402_1K_1%_0.0625W_100PPM) 1%
- (in symbol R0402_10K_1%_0.0625W_100PPM) 1%
- (in symbol R0402_13K_1%_0.0625W_100PPM) 1%
- (in symbol R0402_68K_1%_0.0625W_100PPM) 1%
- (in symbol R1206_1M_1%_0.25W_100PPM) 1%
- (in symbol REL_TYCO_PE014F05, part A) +

### Library data of the parts
C281 C285 C286 C288 C293-C296 = CC0402_1UF_16V_10%_X5R: as C122 on sheet Sensor_Box_CAN_SENS; Part Number: CC0402_1UF_16V_10%_X5R; Component Kind: Standard; Component Type: Standard; Pin Count: 2; Value: 1uF; Status: Preferred; Manufacturer Part Number: CC0402_1UF_16V_10%_X5R; Case: 0402; Mounted: Yes; Socket: No; SMD: Yes; Sense: No; Manufacturer1 Example: TDK; Manufacturer1 ComponentHeight: 0.55mm; HelpURL: \\cern.ch\dfs\Applications\Altium\Datasheets\CC0402_X5R_TDK_C.pdf; Author: CERN DEM JLC; CreateDate: 25.10.2012; LatestRevisionDate: 25.10.2012
C282 C283 = CC0603_22UF_6.3V_20%_X5R: as C123 on sheet Sensor_Box_CAN_SENS; Part Number: CC0603_22UF_6.3V_20%_X5R; Component Kind: Standard; Component Type: Standard; Pin Count: 2; Value: 22uF; Status: None; Manufacturer Part Number: CC0603_22UF_6.3V_20%_X5R; Case: 0603; Mounted: Yes; Socket: No; SMD: Yes; Sense: No; Manufacturer1 Example: TDK; Manufacturer1 ComponentHeight: 1mm; HelpURL: \\cern.ch\dfs\Applications\Altium\Datasheets\CC0603_X5R_TDK_C.pdf; Author: CERN DEM JLC; CreateDate: 16.12.2013; LatestRevisionDate: 13.09.2016
C284 C287 C289-C292 = CC0402_100NF_16V_10%_X5R: as C120 on sheet Sensor_Box_CAN_SENS; Part Number: CC0402_100NF_16V_10%_X5R; Component Kind: Standard; Component Type: Standard; Pin Count: 2; Value: 100nF; Status: None; Manufacturer Part Number: CC0402_100NF_16V_10%_X5R; Case: 0402; Mounted: Yes; Socket: No; SMD: Yes; Sense: No; Manufacturer1 Example: MURATA; Manufacturer1 ComponentHeight: 0.55mm; HelpURL: \\cern.ch\dfs\Applications\Altium\Datasheets\CC0402_X5R_MURATA_GRM.pdf; Author: CERN DEM JLC; CreateDate: 10.12.2013; LatestRevisionDate: 10.12.2013
D119 D122 D123 = 1N4148WS: as D29 on sheet Sensor_Box_CAN_SENS; Part Number: 1N4148WS; Component Kind: Standard; Component Type: Standard; Device: 1N4148WS; PackageDescription: SODFL Diode; 1.70mm W X 1.25mm L X 1.00mm H body, IPC Medium Density; Manufacturer Part Number: 1N4148WS; Pin Count: 2; Case: SOD-323F; Mounted: Yes; Socket: No; SMD: Yes; Sense: No; ComponentHeight: 1mm; HelpURL: \\cern.ch\dfs\Applications\Altium\Datasheets\1N4148WS.pdf; Author: CERN DEM JLC; CreateDate: 12.05.2011; LatestRevisionDate: 12.05.2011
D120 = SMBJ15A: as D62 on sheet Sensor_Box_CAN_SENS; Part Number: SMBJ15A; Component Kind: Standard; Component Type: Standard; Device: SMBJ15A; PackageDescription: DO-214-AA/SMB Diode, Molded Body; 5.34mm L X 3.625mm W X 2.65mm H, IPC Medium Density; Manufacturer Part Number: SMBJ15A; Pin Count: 2; Case: DO-214AA; Mounted: Yes; Socket: No; SMD: Yes; Sense: No; ComponentHeight: 2.65mm; HelpURL: \\cern.ch\dfs\Applications\Altium\Datasheets\SMBJ.pdf; Author: CERN DEM JLC; CreateDate: 08.12.2008; LatestRevisionDate: 19.12.2011
D121 = D_TVS_PESD1CAN: as D28 on sheet Sensor_Box_CAN_SENS; Part Number: PESD1CAN-UX; Component Kind: Standard; Component Type: Standard; Device: PESD1CAN-UX; PackageDescription: SOT, 0.95mm, pitch; 3 pin,1.30mm W X 2.92mm L X 1.12mm H body, IPC Medium Density; Part Description: TVS Diode for CAN; Manufacturer Part Number: PESD1CAN-UX; Pin Count: 3; Case: SOT-23; Mounted: Yes; Socket: No; SMD: Yes; Sense: No; ComponentHeight: 1.12mm; HelpURL: \\cern.ch\dfs\Applications\Altium\Datasheets\SM712.TCT.pdf; Author: CERN DEM JLC; CreateDate: 03.09.2014; LatestRevisionDate: 13.01.2015
IC97 = IFC_MCP2551: as IC34 on sheet Sensor_Box_CAN_SENS; Part Number: MCP2551-I/SN; Component Kind: Standard; Component Type: Standard; Device: MCP2551-I/SN; PackageDescription: SOIC 8, Pitch 1.27mm - Body 4x5mm, IPC Medium Density; Part Description: High-Speed CAN Transceiver; Manufacturer Part Number: MCP2551-I/SN; Pin Count: 8; Case: SOIC8; Mounted: Yes; Socket: No; SMD: Yes; Sense: No; ComponentHeight: 1.75mm; Author: GK; CreateDate: 07.09.2016; LatestRevisionDate: 07.09.2016
IC98 = AP65111AWU-7: as IC36 on sheet Sensor_Box_CAN_SENS; Part Number: AP65111AWU-7; Component Kind: Standard; Component Type: Standard; Device: AP65111AWU-7; PackageDescription: SOT23, 0.95mm pitch; 6 pin, 1.625mm W X 2.90mm L X 1.00mm H body, IPC Medium Density; Part Description: Light Load Improved 1.5A Synch DC/DC Buck Converter; Manufacturer Part Number: AP65111AWU-7; Pin Count: 6; Case: SOT23-6; Mounted: Yes; Socket: No; SMD: Yes; Sense: No; ComponentHeight: 1.1mm; HelpURL: \\cern.ch\dfs\Applications\Altium\Datasheets\AP65111AWU-7.pdf; Author: CERN DEM JLC; CreateDate: 20.03.2018; LatestRevisionDate: 20.03.2018
IC99 = AP7313-33SAG-7: as IC105 on sheet Sensor_Box_CAN_SENS; Part Number: AP7313-33SAG-7; Component Kind: Standard; Component Type: Standard; Device: AP7313-33SAG-7; PackageDescription: SOT23 3-Leads, Pitch 0.95mm - Body 1.3x2.9mm, IPC Medium Density; Manufacturer Part Number: AP7313-33SAG-7; Pin Count: 3; Case: SOT23; Mounted: Yes; Socket: No; SMD: Yes; Sense: No; ComponentHeight: 1.35mm; HelpURL: \\cern.ch\dfs\Applications\Altium\Datasheets\AP7313-33SAG-7.pdf; Author: CERN DEM JLC; CreateDate: 20.03.2018; LatestRevisionDate: 20.03.2018
IC100 = MEM_M24256-BRDW6P: as IC29 on sheet Sensor_Box_CAN_SENS; Part Number: M24256-BRDW6P; Component Kind: Standard; Component Type: Standard; Device: M24256-BRDW6; PackageDescription: SOP, 0.65mm pitch; 8 pin, 4.40mm W X 3.00mm L X 1.20mm H body, IPC Medium Density; Part Description: 256-Kbit Serial I²C Bus EEPROM; Manufacturer Part Number: M24256-BRDW6; Pin Count: 8; Case: TSSOP8; Mounted: Yes; Socket: No; SMD: Yes; Sense: No; ComponentHeight: 1.2mm; HelpURL: \\cern.ch\dfs\Applications\Altium\Datasheets\M24256-BRDW6P.pdf; Author: CERN DEM MR; CreateDate: 17.03.2016; LatestRevisionDate: 17.03.2016
IC101 = CMP-0304-00104-1: as IC104 on sheet Sensor_Box_CAN_SENS; ComponentLink2Description: Datasheet; Mounting Technology: Surface Mount; ComponentLink1Description: Manufacturer URL; ComponentLink1URL: http://www.st.com/; Core: ARM Cortex-M0; Package Reference: UFQFPN48; Packing: Tray; ComponentLink2URL: http://www.st.com/st-web-ui/static/active/en/resource/technical/document/datasheet/DM00105814.pdf; DatasheetVersion: Rev. 5; Package Description: 48-Pin Ultra Thin Fine Pitch Quad Flat No-Lead, 7 x 7 x 0.6 mm Body, 0.5 mm Pitch, Exposed Pad
IC102 = SN74HCT244PW: Octal Buffer/Driver with 3-State Ouputs; Part Description: Octal Buffer And Line Driver with 3-State Ouputs; Manufacturer: TEXAS INSTRUMENTS; PressFit: No; Bonding: No; Part Number: SN74HCT244PW; Component Kind: Standard; Component Type: Standard; Device: SN74HCT244PW; PackageDescription: SOP, 20-Leads, Body 6.5x4.4mm, Pitch 0.65mm, IPC Medium Density; Manufacturer Part Number: SN74HCT244PW; Pin Count: 20; Case: TSSOP20; Mounted: Yes; Socket: No; SMD: Yes; Sense: No; ComponentHeight: 1.2mm; Author: CERN DEM JLC; HelpURL: \\cern.ch\dfs\Applications\Altium\Datasheets\SN74HCT244PW.pdf; CreateDate: 11.10.2011; LatestRevisionDate: 11.10.2011
IC103 = LM358AD: as IC67 on sheet Sensor_Box_CAN_Shutter_CTRL; Part Number: LM358AD; Component Kind: Standard; Component Type: Standard; Device: LM358AD; PackageDescription: SOIC 8, Pitch 1.27mm - Body 4x5mm, IPC Medium Density; Part Description: Dual Operational Amplifier; Manufacturer Part Number: LM358AD; Pin Count: 8; Case: SOIC8; Mounted: Yes; Socket: No; SMD: Yes; Sense: No; ComponentHeight: 1.75mm; Author: CERN DEM JLC; HelpURL: \\cern.ch\dfs\Applications\Altium\Datasheets\LM358AD.pdf; CreateDate: 02.12.2008; LatestRevisionDate: 13.04.2010
J105 = PHOENIX_1725698: Terminal Block, 6 Positions, Screw Connection; Part Description: 6A, 63V, Terminal Block, Pitch 2.54mm, 6 Positions, Screw Connection; Manufacturer: PHOENIX CONTACT; Manufacturer Part Number: 1725698 (MPT 0,5/6-2,54); PressFit: No; Part Number: PHOENIX_1725698; Component Kind: Standard; Component Type: Standard; Pin Count: 6; Mounted: Yes; Socket: No; SMD: No; Sense: No; Status: None; ComponentHeight: 8.5mm; HelpURL: \\cern.ch\dfs\Applications\Altium\Datasheets\PHOENIX_1725698.pdf; Author: CERN DEM JMW; CreateDate: 07.11.2008; LatestRevisionDate: 26.04.2010
J106 = TYCO_282836-4: as J83 on sheet Sensor_Box_CAN_Shutter_CTRL; Part Number: TYCO_282836-4; Component Kind: Standard; Component Type: Standard; Pin Count: 4; Mounted: Yes; Socket: No; SMD: No; Sense: No; Status: None; Manufacturer Part Number: 282836-4; ComponentHeight: 10mm; HelpURL: \\cern.ch\dfs\Applications\Altium\Datasheets\TYCO_282836-4.pdf; Author: CERN DEM JLC; CreateDate: 10.11.2014; LatestRevisionDate: 10.11.2014
JP10 = CON_2x5 1.27 SMT Male: 1.27 mm dual row goldpin (Maritex)
L15 = IND_WLPN3030: as L9 on sheet Sensor_Box_CAN_SENS; Component Kind: Standard; Component Type: Standard; Pin Count: 2; Value: 6.8uH; Status: None; Power: 900mA; Mounted: Yes; Socket: No; SMD: Yes; Sense: No; ComponentHeight: 1.5; HelpURL: \\cern.ch\dfs\Applications\Altium\Datasheets\IND_MURATA-PS_8200.pdf; Author: GK; CreateDate: 11.07.2016; LatestRevisionDate: 11.07.2016
LD32 LD33 = LED_KINGBRIGHT_KPH-1608CGCK: as LD6#2 on sheet Sensor_Box_CAN_Shutter_CTRL; Part Number: LED_KINGBRIGHT_KPH-1608CGCK; Component Kind: Standard; Component Type: Standard; Color: Green; PackageDescription: SMT Green LED, Case 0603, Body L 1.6 x W 0.8mm H 0.65mm; Manufacturer: KINGBRIGHT; Manufacturer Part Number: KPH-1608CGCK; Pin Count: 2; Mounted: Yes; Socket: No; SMD: Yes; Sense: No; ComponentHeight: 0.65mm; HelpURL: \\cern.ch\dfs\Applications\Altium\Datasheets\LED_KINGBRIGHT_KPH-1608CGCK.pdf; Author: CERN DEM JLC; CreateDate: 03.07.2017; LatestRevisionDate: 03.07.2017
R415 R419 R421 = R0402_13K_1%_0.0625W_100PPM: as R137 on sheet Sensor_Box_CAN_SENS; Part Number: R0402_13K_1%_0.0625W_100PPM; Component Kind: Standard; Component Type: Standard; Pin Count: 2; Value: 13k; Status: Not Recommended; Power: 0.0625W; Tolerance: ±1%; Manufacturer Part Number: R0402_13K_1%_0.0625W_100PPM; Case: 0402; Mounted: Yes; Sense: No; Socket: No; SMD: Yes; Manufacturer1 Example: YAGEO PHYCOMP; Manufacturer1 ComponentHeight: 0.4mm; HelpURL: \\cern.ch\dfs\Applications\Altium\Datasheets\R0402_Phycomp_RC0402.pdf; Author: CERN DEM JLC; CreateDate: 03.12.2007; LatestRevisionDate: 17.10.2012
R416 R420 R422 R425 = R0402_1K_1%_0.0625W_100PPM: as R215#3 on sheet Sensor_Box_CAN_SENS; Part Number: R0402_1K_1%_0.0625W_100PPM; Component Kind: Standard; Component Type: Standard; Pin Count: 2; Value: 1k; Status: Not Recommended; Power: 0.0625W; Tolerance: ±1%; Manufacturer Part Number: R0402_1K_1%_0.0625W_100PPM; Case: 0402; Mounted: Yes; Sense: No; Socket: No; SMD: Yes; Manufacturer1 Example: YAGEO PHYCOMP; Manufacturer1 ComponentHeight: 0.4mm; HelpURL: \\cern.ch\dfs\Applications\Altium\Datasheets\R0402_Phycomp_RC0402.pdf; Author: CERN DEM JLC; CreateDate: 03.12.2007; LatestRevisionDate: 17.10.2012
R417 R418 = R0402_68K_1%_0.0625W_100PPM: as R135 on sheet Sensor_Box_CAN_SENS; Part Number: R0402_68K_1%_0.0625W_100PPM; Component Kind: Standard; Component Type: Standard; Pin Count: 2; Value: 68k; Status: Not Recommended; Power: 0.0625W; Tolerance: ±1%; Manufacturer Part Number: R0402_68K_1%_0.0625W_100PPM; Case: 0402; Mounted: Yes; Sense: No; Socket: No; SMD: Yes; Manufacturer1 Example: YAGEO PHYCOMP; Manufacturer1 ComponentHeight: 0.4mm; HelpURL: \\cern.ch\dfs\Applications\Altium\Datasheets\R0402_Phycomp_RC0402.pdf; Author: CERN DEM JLC; CreateDate: 03.12.2007; LatestRevisionDate: 17.10.2012
R423 R424 R426-R430 = R0402_10K_1%_0.0625W_100PPM: as R133 on sheet Sensor_Box_CAN_SENS; Part Number: R0402_10K_1%_0.0625W_100PPM; Component Kind: Standard; Component Type: Standard; Pin Count: 2; Value: 10k; Status: Not Recommended; Power: 0.0625W; Tolerance: ±1%; Manufacturer Part Number: R0402_10K_1%_0.0625W_100PPM; Case: 0402; Mounted: Yes; Sense: No; Socket: No; SMD: Yes; Manufacturer1 Example: YAGEO PHYCOMP; Manufacturer1 ComponentHeight: 0.4mm; HelpURL: \\cern.ch\dfs\Applications\Altium\Datasheets\R0402_Phycomp_RC0402.pdf; Author: CERN DEM JLC; CreateDate: 03.12.2007; LatestRevisionDate: 17.10.2012
R431 R432 R434 R435 = R1206_1M_1%_0.25W_100PPM: as R158 on sheet Sensor_Box_CAN_Shutter_CTRL; Part Number: R1206_1M_1%_0.25W_100PPM; Component Kind: Standard; Component Type: Standard; Pin Count: 2; Value: 1M; Status: Preferred; Tolerance: ±1%; Manufacturer Part Number: R1206_1M_1%_0.25W_100PPM; Case: 1206; Mounted: Yes; Sense: No; Socket: No; SMD: Yes; Manufacturer1 Example: NIC COMPONENT; Manufacturer1 ComponentHeight: 0.65mm; HelpURL: \\cern.ch\dfs\Applications\Altium\Datasheets\R1206_NIC_NRC.pdf; Author: CERN DEM JLC; CreateDate: 03.12.2007; LatestRevisionDate: 13.03.2008
R433 R436-R438 = R0402_10K_1%_0.0625W_100PPM: as R139-R141 on sheet Sensor_Box_CAN_SENS; Part Number: R0402_10K_1%_0.0625W_100PPM; Component Kind: Standard; Component Type: Standard; Pin Count: 2; Value: 10k; Status: Not recommended; Power: 0.0625W; Tolerance: ±1%; Manufacturer Part Number: R0402_10K_1%_0.0625W_100PPM; Case: 0402; Mounted: Yes; Socket: No; SMD: Yes; Manufacturer1 Example: YAGEO PHYCOMP; Manufacturer1 ComponentHeight: 0.4mm; HelpURL: \\cern.ch\dfs\Applications\Altium\Datasheets\R0402_Phycomp_RC0402.pdf; Author: CERN DEM JLC; CreateDate: 2007-12-03; LatestRevisionDate: 2012-10-17
RL8 = REL_TYCO_PE014F05: 1 form C (CO) General Purpose Low Power PCB Relay, PE Series; Part Description: 5A/250VAC 1 form C (CO) General Purpose Low Power PCB Relay, PE Series; Manufacturer: TYCO SCHRACK; Manufacturer Part Number: PE014F05 or 1-1415390-1; PressFit: No; Value: 5VDC; Part Number: REL_TYCO_PE014F05; Component Kind: Standard; Component Type: Standard; Pin Count: 5; PackageDescription: 1 form C (CO) General Purpose Low Power PCB Relay, PE Series, Body 20mm x 10mm; Mounted: Yes; Socket: No; SMD: No; Sense: No; Status: None; ComponentHeight: 10mm; HelpURL: \\cern.ch\dfs\Applications\Altium\Datasheets\REL_TYCO_PE014F05.pdf; Author: CERN DEM JLC; CreateDate: 20.03.2018; LatestRevisionDate: 20.03.2018
TP43-TP48 = SMD_PAD_1.27X1.27MM: as TP5 on sheet Sensor_Box_CAN_SENS; Part Number: SMD_PAD_1.27X1.27MM; Component Kind: Standard (No BOM); Component Type: Standard (No BOM); Pin Count: 1; Family: Test Point; Socket: No; SMD: Yes; Sense: No; Status: None; ComponentHeight: 0mm; HelpURL: Undefined; Author: CERN DEM JLC; CreateDate: 12.01.2008; LatestRevisionDate: 12.01.2008; PackageDescription: 1.27mm x 1.27mm PCB Copper Area (SMD Test Point)